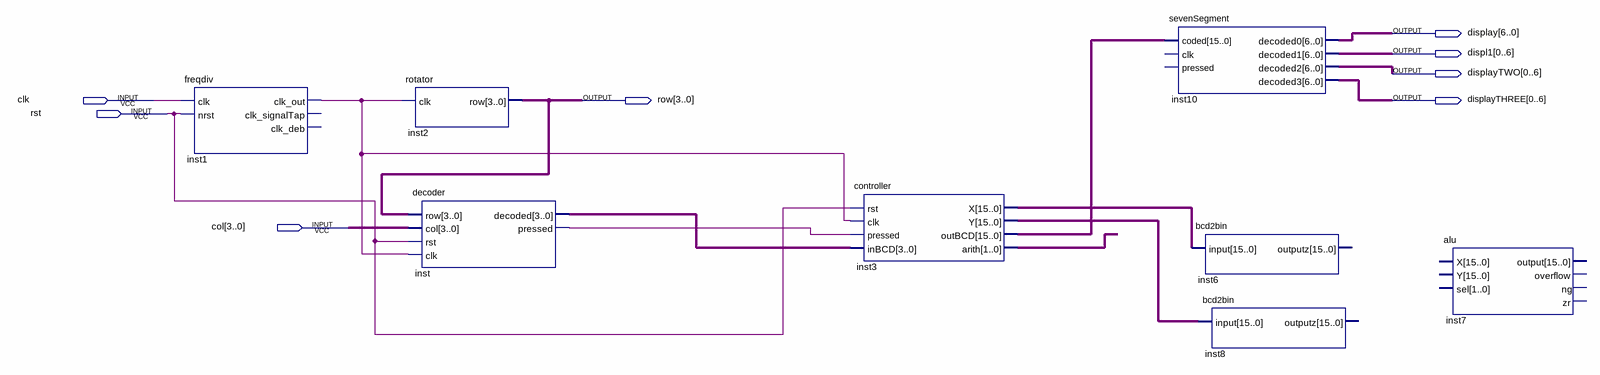
[diagram p0: schematic sheet]
// Quartus schematic calculator.bdf as structural Verilog: 8 symbols, 8 pins
module calculator (
  input  clk,
  input  rst,
  input  [3:0] col,
  output [6:0] display,
  output [0:6] displ1,
  output [0:6] displayTWO,
  output [3:0] row,
  output [0:6] displayTHREE
);

  wire inst1_clk_out, inst_pressed;
  wire [1:0] inst3_arith;
  wire [3:0] inst_decoded;
  wire [15:0] inst3_outbcd, inst3_x, inst3_y;

  freqdiv inst1 (.clk(clk), .nrst(rst), .clk_out(inst1_clk_out));  // open: clk_signalTap, clk_deb
  rotator inst2 (.clk(inst1_clk_out), .row(row));
  decoder inst (.row(row), .col(col), .rst(rst), .clk(inst1_clk_out), .decoded(inst_decoded), .pressed(inst_pressed));
  controller inst3 (
    .rst(rst), .clk(inst1_clk_out), .pressed(inst_pressed), .inBCD(inst_decoded), .X(inst3_x), .Y(inst3_y),
    .outBCD(inst3_outbcd), .arith(inst3_arith));
  sevenSegment inst10 (
    .coded(inst3_outbcd), .decoded0(display), .decoded1(displ1), .decoded2(displayTWO),
    .decoded3(displayTHREE));  // open: clk, pressed
  bcd2bin inst6 (.\input (inst3_x));  // open: outputz
  bcd2bin inst8 (.\input (inst3_y));  // open: outputz
  alu inst7 ();  // open: X, Y, sel, output, overflow, ng, zr
endmodule
